# EAGLE schematic RGBW_Controller (EAGLE 9.4.1)
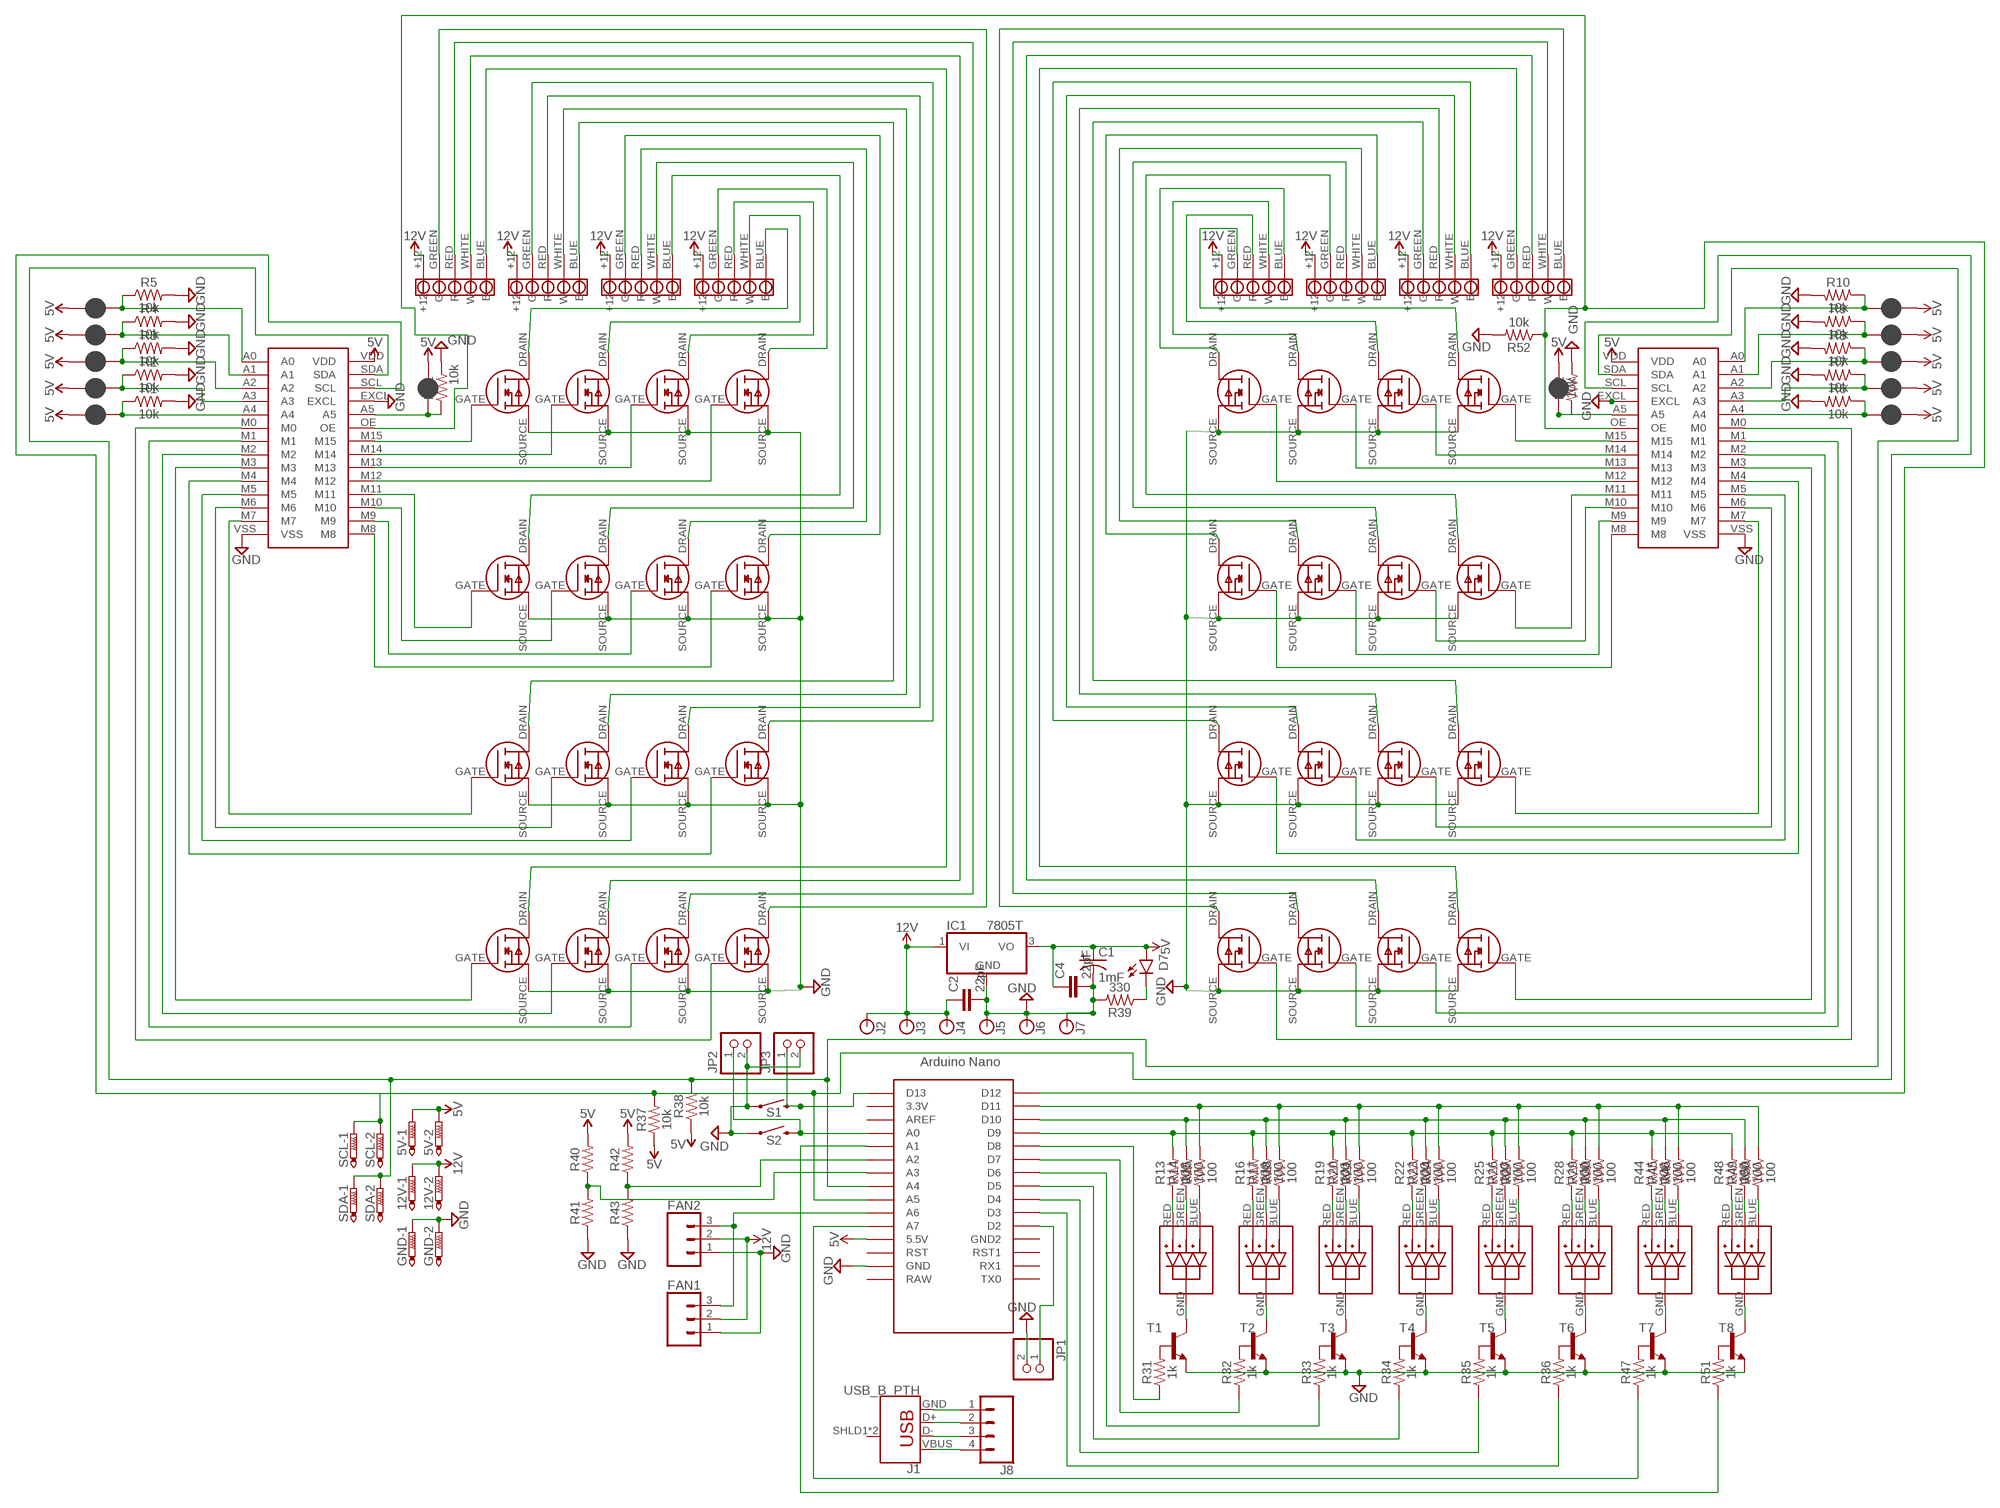
[diagram p0: schematic, sheet 1]

## Parts
5V  PTR2  [P2-38-17]
12V  PTR2  [P2-38-17]
C1  1mF  1000UF-RADIAL-5MM-25V-20%  [CPOL-RADIAL-5MM-10MM]
C2  22pF  22PF-PTH-2.54MM-200V-5%  [CAP-PTH-2.54]
C4  22pF  22PF-PTH-2.54MM-200V-5%  [CAP-PTH-2.54]
D7  LED5MM  [LED_5MM]
FAN1  CONN_03  [1X03]
FAN2  CONN_03  [1X03]
GND  PTR2  [P2-38-17]
IC1  7805T  [TO220H]
J1  USB_B_PTH  [USB-B-PTH]
J1_  JUMPER-SMT_2_NC_PASTE_SILK  [SMT-JUMPER_2_NC_PASTE_SILK]
J2  BANANA_CONN  [BANANA_CONN]
J2_  JUMPER-SMT_2_NC_PASTE_SILK  [SMT-JUMPER_2_NC_PASTE_SILK]
J3  BANANA_CONN  [BANANA_CONN]
J3_  JUMPER-SMT_2_NC_PASTE_SILK  [SMT-JUMPER_2_NC_PASTE_SILK]
J4  BANANA_CONN  [BANANA_CONN]
J4_  JUMPER-SMT_2_NC_PASTE_SILK  [SMT-JUMPER_2_NC_PASTE_SILK]
J5  BANANA_CONN  [BANANA_CONN]
J5_  JUMPER-SMT_2_NC_PASTE_SILK  [SMT-JUMPER_2_NC_PASTE_SILK]
J6  BANANA_CONN  [BANANA_CONN]
J6_  JUMPER-SMT_2_NC_PASTE_SILK  [SMT-JUMPER_2_NC_PASTE_SILK]
J7  BANANA_CONN  [BANANA_CONN]
J7_  JUMPER-SMT_2_NC_PASTE_SILK  [SMT-JUMPER_2_NC_PASTE_SILK]
J8  CONN_04  [1X04]
J8_  JUMPER-SMT_2_NC_PASTE_SILK  [SMT-JUMPER_2_NC_PASTE_SILK]
J9_  JUMPER-SMT_2_NC_PASTE_SILK  [SMT-JUMPER_2_NC_PASTE_SILK]
J10_  JUMPER-SMT_2_NC_PASTE_SILK  [SMT-JUMPER_2_NC_PASTE_SILK]
J11_  JUMPER-SMT_2_NC_PASTE_SILK  [SMT-JUMPER_2_NC_PASTE_SILK]
J12_  JUMPER-SMT_2_NC_PASTE_SILK  [SMT-JUMPER_2_NC_PASTE_SILK]
JP1  PINHD-1X2  [1X02]
JP2  PINHD-1X2  [1X02]
JP3  PINHD-1X2  [1X02]
R1  10k  10KOHM-HORIZ-1/4W-1%  [AXIAL-0.3]
R2  10k  10KOHM-HORIZ-1/4W-1%  [AXIAL-0.3]
R3  10k  10KOHM-HORIZ-1/4W-1%  [AXIAL-0.3]
R4  10k  10KOHM-HORIZ-1/4W-1%  [AXIAL-0.3]
R5  10k  10KOHM-HORIZ-1/4W-1%  [AXIAL-0.3]
R6  10k  10KOHM-HORIZ-1/4W-1%  [AXIAL-0.3]
R7  10k  10KOHM-HORIZ-1/4W-1%  [AXIAL-0.3]
R8  10k  10KOHM-HORIZ-1/4W-1%  [AXIAL-0.3]
R9  10k  10KOHM-HORIZ-1/4W-1%  [AXIAL-0.3]
R10  10k  10KOHM-HORIZ-1/4W-1%  [AXIAL-0.3]
R11  10k  10KOHM-HORIZ-1/4W-1%  [AXIAL-0.3]
R12  10k  10KOHM-HORIZ-1/4W-1%  [AXIAL-0.3]
R13  100  100OHM-HORIZ-1/4W-1%  [AXIAL-0.3]
R14  100  100OHM-HORIZ-1/4W-1%  [AXIAL-0.3]
R15  100  100OHM-HORIZ-1/4W-1%  [AXIAL-0.3]
R16  100  100OHM-HORIZ-1/4W-1%  [AXIAL-0.3]
R17  100  100OHM-HORIZ-1/4W-1%  [AXIAL-0.3]
R18  100  100OHM-HORIZ-1/4W-1%  [AXIAL-0.3]
R19  100  100OHM-HORIZ-1/4W-1%  [AXIAL-0.3]
R20  100  100OHM-HORIZ-1/4W-1%  [AXIAL-0.3]
R21  100  100OHM-HORIZ-1/4W-1%  [AXIAL-0.3]
R22  100  100OHM-HORIZ-1/4W-1%  [AXIAL-0.3]
R23  100  100OHM-HORIZ-1/4W-1%  [AXIAL-0.3]
R24  100  100OHM-HORIZ-1/4W-1%  [AXIAL-0.3]
R25  100  100OHM-HORIZ-1/4W-1%  [AXIAL-0.3]
R26  100  100OHM-HORIZ-1/4W-1%  [AXIAL-0.3]
R27  100  100OHM-HORIZ-1/4W-1%  [AXIAL-0.3]
R28  100  100OHM-HORIZ-1/4W-1%  [AXIAL-0.3]
R29  100  100OHM-HORIZ-1/4W-1%  [AXIAL-0.3]
R30  100  100OHM-HORIZ-1/4W-1%  [AXIAL-0.3]
R31  1k  1KOHM-HORIZ-1/4W-5%  [AXIAL-0.3]
R32  1k  1KOHM-HORIZ-1/4W-5%  [AXIAL-0.3]
R33  1k  1KOHM-HORIZ-1/4W-5%  [AXIAL-0.3]
R34  1k  1KOHM-HORIZ-1/4W-5%  [AXIAL-0.3]
R35  1k  1KOHM-HORIZ-1/4W-5%  [AXIAL-0.3]
R36  1k  1KOHM-HORIZ-1/4W-5%  [AXIAL-0.3]
R37  10k  10KOHM-HORIZ-1/4W-5%  [AXIAL-0.3]
R38  10k  10KOHM-HORIZ-1/4W-5%  [AXIAL-0.3]
R39  330  330OHM-HORIZ-1/10W-5%  [AXIAL-0.3]
R40  10  10OHM-VERT-1/4W-1%  [AXIAL-0.1]
R41  10  10OHM-HORIZ-1/4W-1%  [AXIAL-0.3]
R42  10  10OHM-VERT-1/4W-1%  [AXIAL-0.1]
R43  10  10OHM-HORIZ-1/4W-1%  [AXIAL-0.3]
R44  100  100OHM-HORIZ-1/4W-1%  [AXIAL-0.3]
R45  100  100OHM-HORIZ-1/4W-1%  [AXIAL-0.3]
R46  100  100OHM-HORIZ-1/4W-1%  [AXIAL-0.3]
R47  1k  1KOHM-HORIZ-1/4W-5%  [AXIAL-0.3]
R48  100  100OHM-HORIZ-1/4W-1%  [AXIAL-0.3]
R49  100  100OHM-HORIZ-1/4W-1%  [AXIAL-0.3]
R50  100  100OHM-HORIZ-1/4W-1%  [AXIAL-0.3]
R51  1k  1KOHM-HORIZ-1/4W-5%  [AXIAL-0.3]
R52  10k  10KOHM-HORIZ-1/4W-1%  [AXIAL-0.3]
S1  MOMENTARY-SWITCH-SPST-PTH-6.0MM  [TACTILE_SWITCH_PTH_6.0MM]
S2  MOMENTARY-SWITCH-SPST-PTH-6.0MM  [TACTILE_SWITCH_PTH_6.0MM]
SCL  PTR2  [P2-38-17]
SDA  PTR2  [P2-38-17]
T1  -NPN-TO92-EBC  [TO92-EBC]
T2  -NPN-TO92-EBC  [TO92-EBC]
T3  -NPN-TO92-EBC  [TO92-EBC]
T4  -NPN-TO92-EBC  [TO92-EBC]
T5  -NPN-TO92-EBC  [TO92-EBC]
T6  -NPN-TO92-EBC  [TO92-EBC]
T7  -NPN-TO92-EBC  [TO92-EBC]
T8  -NPN-TO92-EBC  [TO92-EBC]
U$1  16CH_PWM  [16CH_PWM]
U$2  MOSFET  [MOSFET]
U$3  MOSFET  [MOSFET]
U$4  MOSFET  [MOSFET]
U$5  MOSFET  [MOSFET]
U$6  MOSFET  [MOSFET]
U$7  MOSFET  [MOSFET]
U$8  MOSFET  [MOSFET]
U$9  MOSFET  [MOSFET]
U$10  MOSFET  [MOSFET]
U$11  MOSFET  [MOSFET]
U$12  MOSFET  [MOSFET]
U$13  MOSFET  [MOSFET]
U$14  MOSFET  [MOSFET]
U$15  MOSFET  [MOSFET]
U$16  MOSFET  [MOSFET]
U$17  MOSFET  [MOSFET]
U$18  16CH_PWM  [16CH_PWM]
U$19  MOSFET  [MOSFET]
U$20  MOSFET  [MOSFET]
U$21  MOSFET  [MOSFET]
U$22  MOSFET  [MOSFET]
U$23  MOSFET  [MOSFET]
U$24  MOSFET  [MOSFET]
U$25  MOSFET  [MOSFET]
U$26  MOSFET  [MOSFET]
U$27  MOSFET  [MOSFET]
U$28  MOSFET  [MOSFET]
U$29  MOSFET  [MOSFET]
U$30  MOSFET  [MOSFET]
U$31  MOSFET  [MOSFET]
U$32  MOSFET  [MOSFET]
U$33  MOSFET  [MOSFET]
U$34  MOSFET  [MOSFET]
U$35  NANO  [NANO]
U$36  5MM_RGB  [5MMRGB]
U$37  5POLE_TERM  [5POLE_TERM]
U$38  5POLE_TERM  [5POLE_TERM]
U$39  5POLE_TERM  [5POLE_TERM]
U$40  5POLE_TERM  [5POLE_TERM]
U$41  5POLE_TERM  [5POLE_TERM]
U$42  5POLE_TERM  [5POLE_TERM]
U$43  5POLE_TERM  [5POLE_TERM]
U$44  5POLE_TERM  [5POLE_TERM]
U$45  5MM_RGB  [5MMRGB]
U$46  5MM_RGB  [5MMRGB]
U$47  5MM_RGB  [5MMRGB]
U$48  5MM_RGB  [5MMRGB]
U$49  5MM_RGB  [5MMRGB]
U$50  5MM_RGB  [5MMRGB]
U$51  5MM_RGB  [5MMRGB]

## Nets
5V: 5V.TP-1 5V.TP-2 C1.+ C4.1 D7.A IC1.3(VO) J1_.1 J2_.1 J3_.1 J4_.1 J5_.1 J6_.1 J7_.1 J8_.1 J9_.1 J10_.1 J11_.1 J12_.1 R37.P$1 R38.P$1 R40.P$2 R42.P$2 U$1.VDD U$18.VDD U$35.5V(5.5V)
12V: 12V.TP-1 12V.TP-2 C2.1 FAN1.2 FAN2.2 IC1.1(VI) J2.P$1 J3.P$1 J4.P$1 U$37.+12 U$38.+12 U$39.+12 U$40.+12 U$41.+12 U$42.+12 U$43.+12 U$44.+12
GND: C1.- C2.2 C4.2 FAN1.1 FAN2.1 GND.TP-1 GND.TP-2 IC1.2(GND) J5.P$1 J6.P$1 J7.P$1 JP1.2 JP2.2 JP3.2 R1.P$2 R2.P$2 R3.P$2 R4.P$2 R5.P$2 R6.P$2 R7.P$2 R8.P$2 R9.P$2 R10.P$2 R11.P$2 R12.P$2 R39.P$2 R41.P$1 R43.P$1 R52.P$2 S1.1 S2.1 T1.E T2.E T3.E T4.E T5.E T6.E T7.E T8.E U$1.EXCL U$1.VSS U$2.SOURCE U$3.SOURCE U$4.SOURCE U$5.SOURCE U$6.SOURCE U$7.SOURCE U$8.SOURCE U$9.SOURCE U$10.SOURCE U$11.SOURCE U$12.SOURCE U$13.SOURCE U$14.SOURCE U$15.SOURCE U$16.SOURCE U$17.SOURCE U$18.EXCL U$18.VSS U$19.SOURCE U$20.SOURCE U$21.SOURCE U$22.SOURCE U$23.SOURCE U$24.SOURCE U$25.SOURCE U$26.SOURCE U$27.SOURCE U$28.SOURCE U$29.SOURCE U$30.SOURCE U$31.SOURCE U$32.SOURCE U$33.SOURCE U$34.SOURCE U$35.GND
N$1: J12_.2 R12.P$1 U$18.A5
N$2: R15.P$2 R18.P$2 R21.P$2 R24.P$2 R27.P$2 R30.P$2 R46.P$2 R50.P$2 U$35.D11
N$3: R13.P$1 U$36.RED
N$4: R14.P$1 U$36.GREEN
N$5: J6_.2 R11.P$1 U$1.A5
N$6: R15.P$1 U$36.BLUE
N$7: U$18.M15 U$19.GATE
N$8: U$18.M14 U$20.GATE
N$9: U$18.M13 U$21.GATE
N$10: U$1.M15 U$2.GATE
N$11: U$1.M14 U$3.GATE
N$12: U$1.M13 U$4.GATE
N$13: U$1.M12 U$5.GATE
N$14: D7.K(C) R39.P$1
N$15: U$2.DRAIN U$43.BLUE(B)
N$16: R16.P$1 U$45.RED
N$17: R17.P$1 U$45.GREEN
N$18: J1_.2 R5.P$1 U$1.A0
N$19: U$1.M11 U$6.GATE
N$20: U$1.M10 U$7.GATE
N$21: U$1.M9 U$8.GATE
N$22: U$1.M8 U$9.GATE
N$23: R18.P$1 U$45.BLUE
N$24: R19.P$1 U$46.RED
N$25: R20.P$1 U$46.GREEN
N$26: R21.P$1 U$46.BLUE
N$27: U$18.M12 U$22.GATE
N$28: U$1.M7 U$10.GATE
N$29: U$1.M6 U$11.GATE
N$30: U$1.M5 U$12.GATE
N$31: U$1.M4 U$13.GATE
N$32: R22.P$1 U$47.RED
N$33: R23.P$1 U$47.GREEN
N$34: R24.P$1 U$47.BLUE
N$35: R25.P$1 U$48.RED
N$36: U$22.DRAIN U$44.BLUE(B)
N$37: U$1.M3 U$14.GATE
N$38: U$1.M2 U$15.GATE
N$39: U$1.M1 U$16.GATE
N$40: U$1.M0 U$17.GATE
N$41: R26.P$1 U$48.GREEN
N$42: R27.P$1 U$48.BLUE
N$43: R28.P$1 U$49.RED
N$44: R29.P$1 U$49.GREEN
N$45: U$21.DRAIN U$44.WHITE(W)
N$46: U$20.DRAIN U$44.RED(R)
N$47: U$19.DRAIN U$44.GREEN(G)
N$48: J2_.2 R4.P$1 U$1.A1
N$49: U$18.M11 U$23.GATE
N$50: U$18.M10 U$24.GATE
N$51: U$18.M9 U$25.GATE
N$52: U$18.M8 U$26.GATE
N$53: U$26.DRAIN U$42.BLUE(B)
N$54: U$25.DRAIN U$42.WHITE(W)
N$55: U$24.DRAIN U$42.RED(R)
N$56: U$23.DRAIN U$42.GREEN(G)
N$57: U$18.M7 U$27.GATE
N$58: U$18.M6 U$28.GATE
N$59: U$18.M5 U$29.GATE
N$60: U$18.M4 U$30.GATE
N$61: U$30.DRAIN U$41.BLUE(B)
N$62: U$29.DRAIN U$41.WHITE(W)
N$63: U$28.DRAIN U$41.RED(R)
N$64: U$27.DRAIN U$41.GREEN(G)
N$65: U$18.M3 U$31.GATE
N$66: U$18.M2 U$32.GATE
N$67: U$18.M1 U$33.GATE
N$68: U$18.M0 U$34.GATE
N$69: U$34.DRAIN U$40.BLUE(B)
N$70: U$33.DRAIN U$40.WHITE(W)
N$71: U$32.DRAIN U$40.RED(R)
N$72: U$31.DRAIN U$40.GREEN(G)
N$73: R30.P$1 U$49.BLUE
N$74: JP3.1 S1.3 U$35.D13
N$75: JP2.1 S2.3 U$35.A0
N$76: T6.C U$49.GND
N$77: T5.C U$48.GND
N$78: T4.C U$47.GND
N$79: J3_.2 R3.P$1 U$1.A2
N$80: J4_.2 R2.P$1 U$1.A3
N$81: J5_.2 R1.P$1 U$1.A4
N$82: J7_.2 R10.P$1 U$18.A0
N$83: J8_.2 R9.P$1 U$18.A1
N$84: J9_.2 R8.P$1 U$18.A2
N$85: J10_.2 R7.P$1 U$18.A3
N$86: J11_.2 R6.P$1 U$18.A4
N$87: T3.C U$46.GND
N$88: T2.C U$45.GND
N$89: T1.C U$36.GND
N$90: J1.GND J8.1
N$91: J1.VBUS J8.4
N$92: J1.D- J8.3
N$93: J1.D+ J8.2
N$94: R40.P$1 R41.P$2 U$35.A3
N$95: R42.P$1 R43.P$2 U$35.A2
N$96: FAN1.3 FAN2.3 U$35.A6
N$97: R52.P$1 U$1.OE U$18.OE U$35.D12
N$98: R13.P$2 R16.P$2 R19.P$2 R22.P$2 R25.P$2 R28.P$2 R44.P$2 R48.P$2 U$35.D9
N$99: JP1.1 U$35.D2
N$100: R37.P$2 SCL.TP-1 SCL.TP-2 U$1.SCL U$18.SCL U$35.A5
N$101: R38.P$2 SDA.TP-1 SDA.TP-2 U$1.SDA U$18.SDA U$35.A4
N$102: R47.P$2 T7.B
N$103: R47.P$1 U$35.A7
N$104: R44.P$1 U$50.RED
N$105: R45.P$1 U$50.GREEN
N$106: R46.P$1 U$50.BLUE
N$107: R31.P$1 U$35.D8
N$108: R31.P$2 T1.B
N$109: R32.P$2 T2.B
N$110: R33.P$2 T3.B
N$111: R34.P$2 T4.B
N$112: R35.P$2 T5.B
N$113: R36.P$2 T6.B
N$114: R32.P$1 U$35.D7
N$115: R33.P$1 U$35.D6
N$116: R34.P$1 U$35.D5
N$117: R35.P$1 U$35.D4
N$118: R36.P$1 U$35.D3
N$119: U$17.DRAIN U$37.GREEN(G)
N$120: U$16.DRAIN U$37.RED(R)
N$121: U$15.DRAIN U$37.WHITE(W)
N$122: U$14.DRAIN U$37.BLUE(B)
N$123: T7.C U$50.GND
N$124: U$13.DRAIN U$38.GREEN(G)
N$125: U$12.DRAIN U$38.RED(R)
N$126: U$11.DRAIN U$38.WHITE(W)
N$127: U$10.DRAIN U$38.BLUE(B)
N$129: U$9.DRAIN U$39.GREEN(G)
N$130: U$8.DRAIN U$39.RED(R)
N$131: U$7.DRAIN U$39.WHITE(W)
N$132: U$6.DRAIN U$39.BLUE(B)
N$134: U$5.DRAIN U$43.GREEN(G)
N$135: U$4.DRAIN U$43.RED(R)
N$136: U$3.DRAIN U$43.WHITE(W)
N$137: R14.P$2 R17.P$2 R20.P$2 R23.P$2 R26.P$2 R29.P$2 R45.P$2 R49.P$2 U$35.D10
N$138: R51.P$2 T8.B
N$139: R51.P$1 U$35.A1
N$140: R48.P$1 U$51.RED
N$141: R49.P$1 U$51.GREEN
N$142: R50.P$1 U$51.BLUE
N$143: T8.C U$51.GND
Unconnected: J1.SHLD1(SHIELD) J1.SHLD2(SHIELD) U$35.3.3V U$35.AREF U$35.GND1(GND2) U$35.ICSP1 U$35.ICSP2 U$35.ICSP3 U$35.ICSP4 U$35.ICSP5 U$35.ICSP6 U$35.RAW U$35.RST U$35.RST1 U$35.RX1 U$35.TX0

## Library data of the parts
5V 12V GND SCL SDA = testpad:PTR2: TEST PIN
C1 = SparkFun-Capacitors:1000UF: 1,000µF/1mF ceramic capacitors A capacitor is a passive two-terminal electrical component used to store electrical energy temporarily in an electric field. CAP-08070; PROD_ID: CAP-09538
C2 C4 = SparkFun-Capacitors:22PF: 22pF ceramic capacitors A capacitor is a passive two-terminal electrical component used to store electrical energy temporarily in an electric field.; PROD_ID: CAP-09128
D7 = SparkFun-LED:LED: LED (Generic) Standard schematic elements and footprints for 5mm, 3mm, 1206, and 0603 sized LEDs. Generic LEDs with no color specified.
FAN1 FAN2 = SparkFun-Connectors:CONN_03: Multi connection point. Often used as Generic Header-pin footprint for 0.1 inch spaced/style header connections On any of the 0.1 inch spaced packages, you can populate with these: Break Away Headers - Straight <https://www.sparkfun.com/products/116> (PRT-00116) Break Away Male Headers - Right Angle <https://www.sparkfun.com/products/553> (PRT-00553) Female Headers <https://www.sparkfun.com/products/115> (PRT-00115) Break Away Headers - Machine Pin <https://www.sparkfun.com/products/117> (PRT-00117) Break Away Female Headers - Swiss Machine Pin <https://www.sparkfun.com/products/743> (PRT-00743) Stackable Header - 3 Pin (Female, 0.1") <https://www.sparkfun.com/products/13875> (PRT-13875) For SCREWTERMINALS and SPRING TERMINALS visit here: Screw Terimnals on SparkFun.com <https://www.sparkfun.com/search/results?term=Screw+Terminals> (5mm/3.5mm/2.54mm spacing) This device is also useful as a general connection point to wire up your design to another part of your project. Our various solder wires solder well into these plated through hole pads. Hook-Up Wire - Assortment (Stranded, 22 AWG) <https://www.sparkfun.com/products/11375> (PRT-11375) Hook-Up Wire - Assortment (Solid Core, 22 AWG) <https://www.sparkfun.com/products/11367> (PRT-11367) View the entire wire category on our website here <https://www.sparkfun.com/categories/141> Special notes: Molex polarized connector foot print use with SKU : PRT-08232 with associated crimp pins and housings.
IC1 = adafruit:78*: Positive VOLTAGE REGULATOR Added bigger pads to the TO-92 package
J1 = SparkFun-Connectors:USB_B: USB Type B Connector SparkFun Products: SparkFun Stepoko <https://www.sparkfun.com/products/13899> PTH; PROD_ID: CONN-08278; SF_ID: PRT-00139
J1_ J2_ J3_ J4_ J5_ J6_ J7_ J8_ J9_ J10_ J11_ J12_ = SparkFun-Jumpers:JUMPER-SMT_2_NC_PASTE: Normally closed solder jumper This jumper has an aperture in the stencil to allow solder paste to bridge the split in the wire so it's normally closed (NC). Wick off the solder to open the connection. Reapply solder to reclose the connection.
J2-J7 = SparkFun-Connectors:BANANA_CONN: Through-hole Banana Jack Basic PTH connection for banana jack plugs SparkFun Products: Multimeter Kit <https://www.sparkfun.com/products/retired/10956> Banana to Alligator Cable <https://www.sparkfun.com/products/retired/509> Banana to Alligator Coax Cable <https://www.sparkfun.com/products/retired/508> Banana to Banana Cable <https://www.sparkfun.com/products/retired/507> Banana to IC Hook Cables <https://www.sparkfun.com/products/retired/506>
J8 = SparkFun-Connectors:CONN_04: Multi connection point. Often used as Generic Header-pin footprint for 0.1 inch spaced/style header connections On any of the 0.1 inch spaced packages, you can populate with these: Break Away Headers - Straight <https://www.sparkfun.com/products/116> (PRT-00116) Break Away Male Headers - Right Angle <https://www.sparkfun.com/products/553> (PRT-00553) Female Headers <https://www.sparkfun.com/products/115> (PRT-00115) Break Away Headers - Machine Pin <https://www.sparkfun.com/products/117> (PRT-00117) Break Away Female Headers - Swiss Machine Pin <https://www.sparkfun.com/products/743> (PRT-00743) For SCREWTERMINALS and SPRING TERMINALS visit here: Screw Terimnals on SparkFun.com <https://www.sparkfun.com/search/results?term=Screw+Terminals> (5mm/3.5mm/2.54mm spacing) This device is also useful as a general connection point to wire up your design to another part of your project. Our various solder wires solder well into these plated through hole pads. Hook-Up Wire - Assortment (Stranded, 22 AWG) <https://www.sparkfun.com/products/11375> (PRT-11375) Hook-Up Wire - Assortment (Solid Core, 22 AWG) <https://www.sparkfun.com/products/11367> (PRT-11367) View the entire wire category on our website here <https://www.sparkfun.com/categories/141> Special notes: Molex polarized connector foot print use with SKU : PRT-08231 with associated crimp pins and housings. 1MM SMD Version SKU: PRT-10208; PROD_ID: CONN-09696
JP1-JP3 = DC_LOAD_AU:PINHD-1X2: PIN HEADER
R1-R12 R52 = SparkFun-Resistors:10KOHM: 10kΩ resistor A resistor is a passive two-terminal electrical component that implements electrical resistance as a circuit element. Resistors act to reduce current flow, and, at the same time, act to lower voltage levels within circuits. - Wikipedia; PROD_ID: RES-12183
R13-R30 R44-R46 R48-R50 = SparkFun-Resistors:100OHM: 100Ω resistor A resistor is a passive two-terminal electrical component that implements electrical resistance as a circuit element. Resistors act to reduce current flow, and, at the same time, act to lower voltage levels within circuits. - Wikipedia; PROD_ID: RES-12181
R31-R36 R47 R51 = SparkFun-Resistors:1KOHM: 1kΩ resistor A resistor is a passive two-terminal electrical component that implements electrical resistance as a circuit element. Resistors act to reduce current flow, and, at the same time, act to lower voltage levels within circuits. - Wikipedia; PROD_ID: RES-08380
R37 R38 = SparkFun-Resistors:10KOHM: 10kΩ resistor A resistor is a passive two-terminal electrical component that implements electrical resistance as a circuit element. Resistors act to reduce current flow, and, at the same time, act to lower voltage levels within circuits. - Wikipedia; PROD_ID: RES-09435
R39 = SparkFun-Resistors:330OHM: 330Ω resistor A resistor is a passive two-terminal electrical component that implements electrical resistance as a circuit element. Resistors act to reduce current flow, and, at the same time, act to lower voltage levels within circuits. - Wikipedia; PROD_ID: RES-8371
R40-R43 = SparkFun-Resistors:10OHM: 10Ω resistor A resistor is a passive two-terminal electrical component that implements electrical resistance as a circuit element. Resistors act to reduce current flow, and, at the same time, act to lower voltage levels within circuits. - Wikipedia; PROD_ID: RES-12180
S1 S2 = SparkFun-Switches:MOMENTARY-SWITCH-SPST: Momentary Switch (Pushbutton) - SPST Normally-open (NO) SPST momentary switches (buttons, pushbuttons). Variants PTH-12MM - 12mm square, through-hole Momentary Pushbutton Switch - 12mm Square <https://www.sparkfun.com/products/9190> (COM-09190) PTH-6.0MM, PTH-6.0MM-KIT - 6.0mm square, through-hole Mini Pushbutton Switch <https://www.sparkfun.com/products/97> (COM-00097) KIT package intended for soldering kit's - only one side of pads' copper is exposed. PTH-RIGHT-ANGLE-KIT - Right-angle, through-hole Right Angle Tactile Button <https://www.sparkfun.com/products/10791> - Used on SparkFun BigTime Watch Kit <https://www.sparkfun.com/products/11734> SMD-12MM - 12mm square, surface-mount Tactile Button - SMD (12mm) <https://www.sparkfun.com/products/12993> (COM-12993) Used on SparkFun PicoBoard <https://www.sparkfun.com/products/11888> SMD-4.5MM - 4.5mm Square Trackball Switch Used on SparkFun Blackberry Trackballer Breakout <https://www.sparkfun.com/products/13169> SMD-4.6MMX2.8MM - 4.60mm x 2.80mm, surface mount Used on SparkFun SAMD21 Mini Breakout <https://www.sparkfun.com/products/13664> SMD-5.2MM, SMD-5.2-REDUNDANT - 5.2mm square, surface-mount Mini Pushbutton Switch - SMD <https://www.sparkfun.com/products/8720> (COM-08720) Used on Arduino Pro Mini <https://www.sparkfun.com/products/11114> REDUNDANT package connects both switch circuits together SMD-6.0X3.5MM - 6.0 x 3.5mm, surface mount Momentary Reset Switch SMD <https://www.sparkfun.com/products/8229> (COM-08229) SMD-6.2MM-TALL - 6.2mm square, surface mount Tactile Button - SMD (6mm) <https://www.sparkfun.com/products/12992> Used on SparkFun Digital Sandbox <https://www.sparkfun.com/products/12651> SMD-RIGHT-ANGLE - Right-angle, surface mount Used on SparkFun Block for Intel® Edison - Arduino <https://www.sparkfun.com/products/13036>; PROD_ID: SWCH-08441; SF_SKU: COM-00097
T1-T8 = DC_LOAD_AU:*-NPN-: NPN Transistror BF959 corrected 2008.03.06
U$1 U$18 = Ceiling:16CH_PWM
U$2-U$4 U$6-U$17 U$19-U$34 = Ceiling:MOSFET
U$5 = Ceiling:MOSFET; SPICEPREFIX: U
U$35 = Arduino-clone:NANO: Arduino Nano
U$36 U$45-U$51 = Ceiling:5MM_RGB
U$37-U$44 = Ceiling:5POLE_TERM